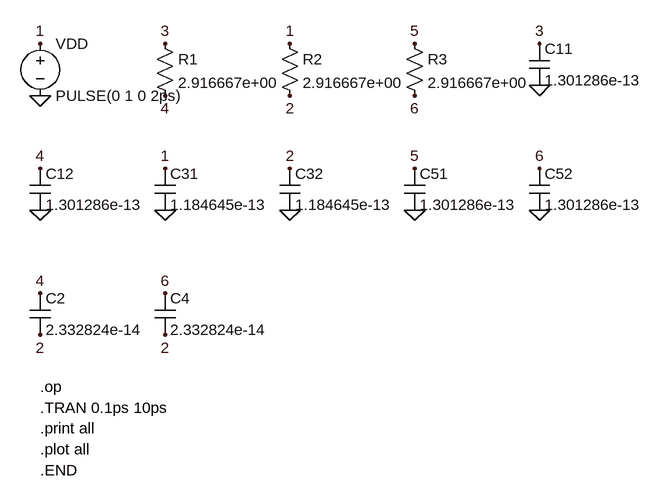
[diagram p0: schematic rc.asc]
rc.asc, the LTspice schematic file:
Version 4
SHEET 1 960 736
FLAG 0 64 1
FLAG 0 144 0
FLAG 192 64 3
FLAG 192 144 4
FLAG 384 64 1
FLAG 384 144 2
FLAG 576 64 5
FLAG 576 144 6
FLAG 768 64 3
FLAG 768 128 0
FLAG 0 256 4
FLAG 0 320 0
FLAG 192 256 1
FLAG 192 320 0
FLAG 384 256 2
FLAG 384 320 0
FLAG 576 256 5
FLAG 576 320 0
FLAG 768 256 6
FLAG 768 320 0
FLAG 0 448 4
FLAG 0 512 2
FLAG 192 448 6
FLAG 192 512 2
SYMBOL voltage 0 48 R0
SYMATTR InstName VDD
SYMATTR Value PULSE(0 1 0 2ps)
SYMBOL res 176 48 R0
SYMATTR InstName R1
SYMATTR Value 2.916667e+00
SYMBOL res 368 48 R0
SYMATTR InstName R2
SYMATTR Value 2.916667e+00
SYMBOL res 560 48 R0
SYMATTR InstName R3
SYMATTR Value 2.916667e+00
SYMBOL cap 752 64 R0
SYMATTR InstName C11
SYMATTR Value 1.301286e-13
SYMBOL cap -16 256 R0
SYMATTR InstName C12
SYMATTR Value 1.301286e-13
SYMBOL cap 176 256 R0
SYMATTR InstName C31
SYMATTR Value 1.184645e-13
SYMBOL cap 368 256 R0
SYMATTR InstName C32
SYMATTR Value 1.184645e-13
SYMBOL cap 560 256 R0
SYMATTR InstName C51
SYMATTR Value 1.301286e-13
SYMBOL cap 752 256 R0
SYMATTR InstName C52
SYMATTR Value 1.301286e-13
SYMBOL cap -16 448 R0
SYMATTR InstName C2
SYMATTR Value 2.332824e-14
SYMBOL cap 176 448 R0
SYMATTR InstName C4
SYMATTR Value 2.332824e-14
TEXT 0 592 Left 2 !.op
TEXT 0 624 Left 2 !.TRAN 0.1ps 10ps
TEXT 0 656 Left 2 !.print all
TEXT 0 688 Left 2 !.plot all
TEXT 0 720 Left 2 !.END

The netlist it stands for:
* rc.asc
VDD 1 0 PULSE(0 1 0 2ps)
R1 3 4 2.916667e+00
R2 1 2 2.916667e+00
R3 5 6 2.916667e+00
C11 3 0 1.301286e-13
C12 4 0 1.301286e-13
C31 1 0 1.184645e-13
C32 2 0 1.184645e-13
C51 5 0 1.301286e-13
C52 6 0 1.301286e-13
C2 4 2 2.332824e-14
C4 6 2 2.332824e-14
.op
.TRAN 0.1ps 10ps
.print all
.plot all
.END
.backanno
.end